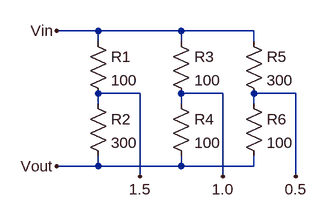
[diagram p0: schematic Divisor.asc]
Divisor.asc, the LTspice schematic file:
Version 4
SHEET 1 880 680
WIRE -352 16 -416 16
WIRE -224 16 -352 16
WIRE -112 16 -224 16
WIRE -352 32 -352 16
WIRE -224 32 -224 16
WIRE -112 32 -112 16
WIRE -288 112 -352 112
WIRE -160 112 -224 112
WIRE -48 112 -112 112
WIRE -352 128 -352 112
WIRE -224 128 -224 112
WIRE -112 128 -112 112
WIRE -352 224 -352 208
WIRE -352 224 -416 224
WIRE -224 224 -224 208
WIRE -224 224 -352 224
WIRE -112 224 -112 208
WIRE -112 224 -224 224
WIRE -288 240 -288 112
WIRE -160 240 -160 112
WIRE -48 240 -48 112
FLAG -416 16 Vin
FLAG -416 224 Vout
FLAG -288 240 1.5
FLAG -160 240 1.0
FLAG -48 240 0.5
SYMBOL res -368 16 R0
SYMATTR InstName R1
SYMATTR Value 100
SYMBOL res -368 112 R0
SYMATTR InstName R2
SYMATTR Value 300
SYMBOL res -240 16 R0
SYMATTR InstName R3
SYMATTR Value 100
SYMBOL res -240 112 R0
SYMATTR InstName R4
SYMATTR Value 100
SYMBOL res -128 16 R0
SYMATTR InstName R5
SYMATTR Value 300
SYMBOL res -128 112 R0
SYMATTR InstName R6
SYMATTR Value 100

The netlist it stands for:
* Divisor.asc
R1 Vin 1.5 100
R2 1.5 Vout 300
R3 Vin 1.0 100
R4 1.0 Vout 100
R5 Vin 0.5 300
R6 0.5 Vout 100
.backanno
.end